# EAGLE schematic usb_speaker (EAGLE 7.7.0)
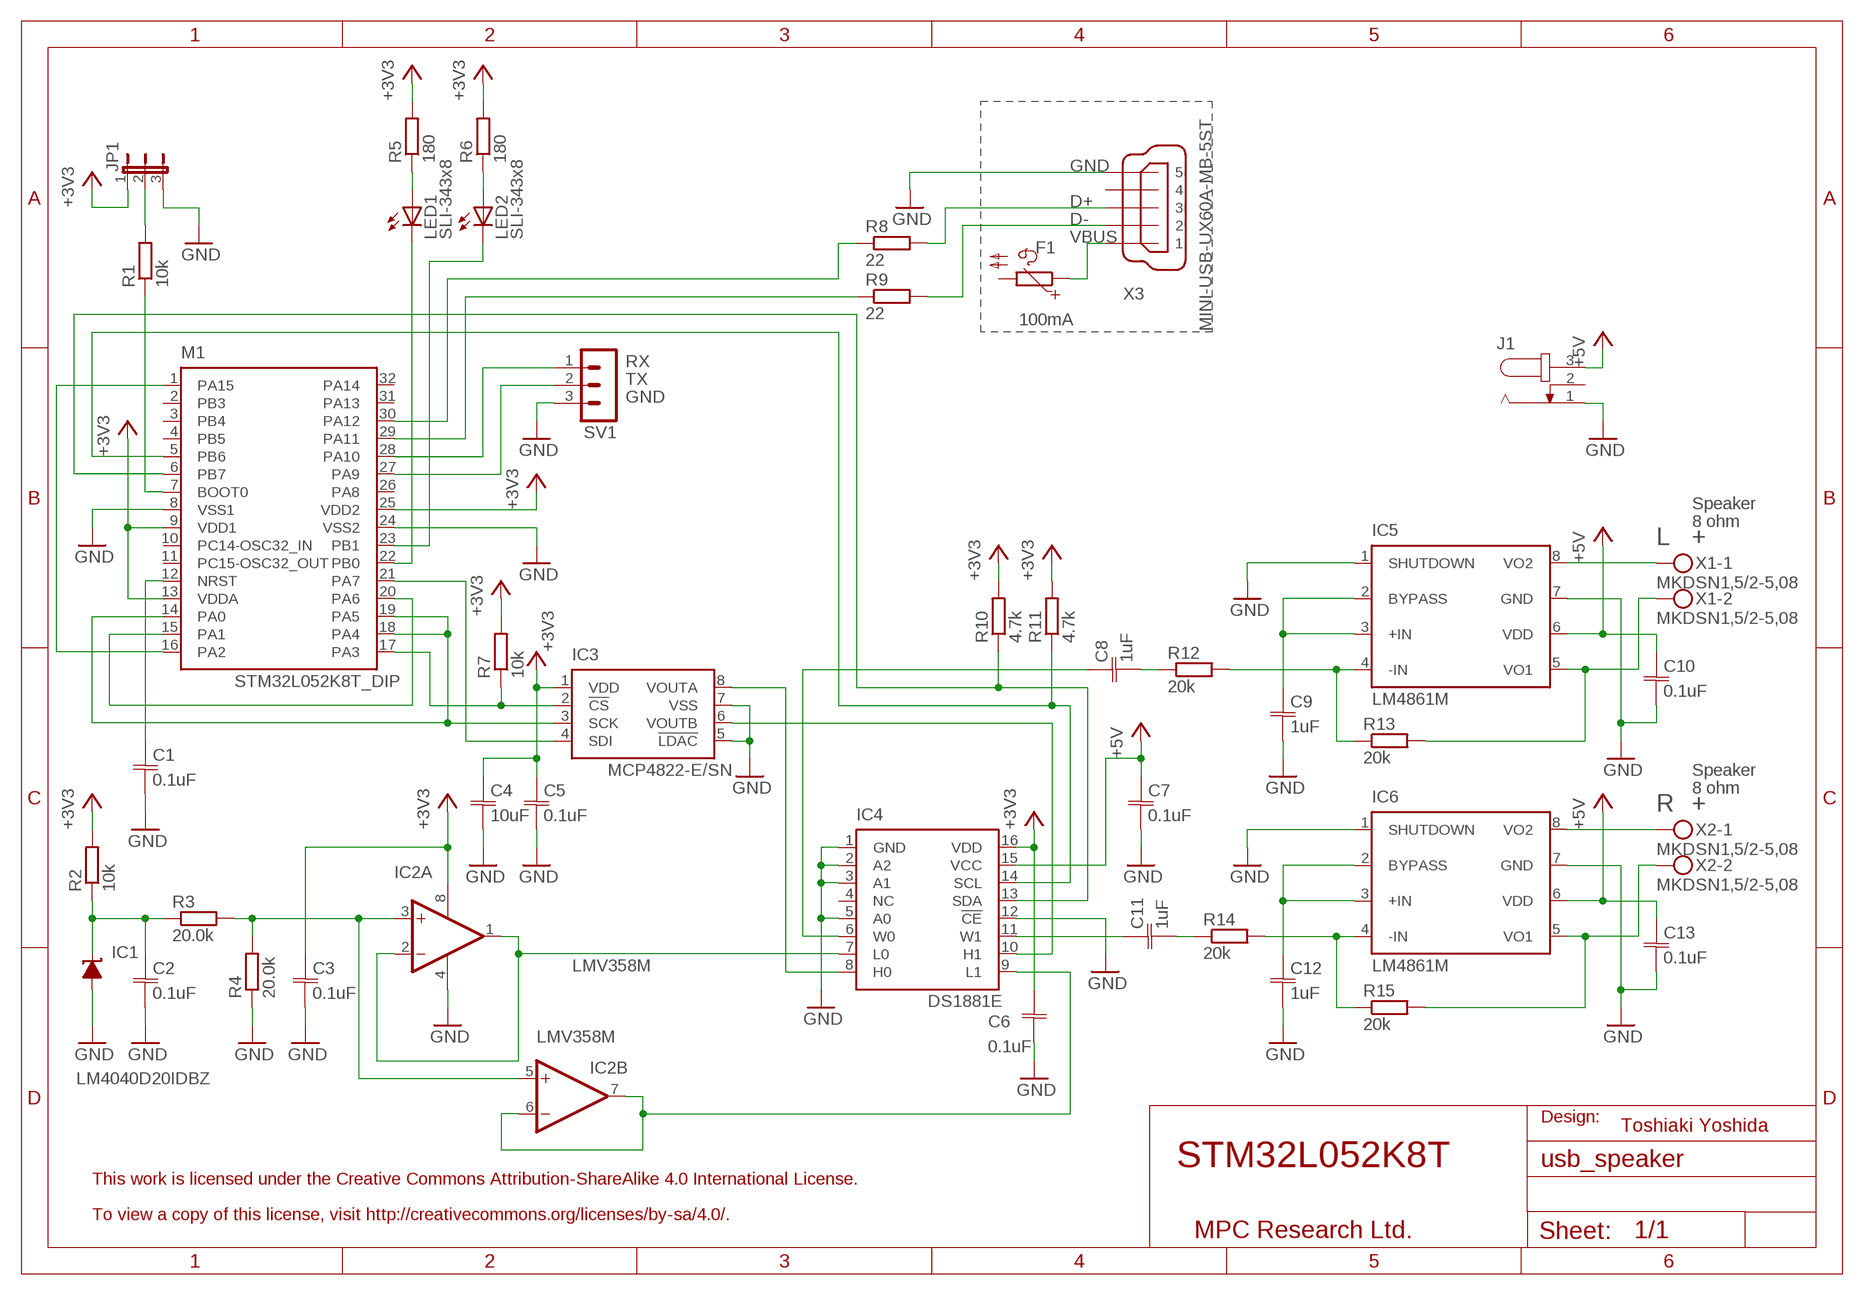
[diagram p0: schematic, sheet 1]

## Parts
C1  0.1uF  C-JIS050-024X044  [C050-024X044]
C2  0.1uF  C-JIS050-024X044  [C050-024X044]
C3  0.1uF  C-JIS050-024X044  [C050-024X044]
C4  10uF  C-JIS050-024X044  [C050-024X044]
C5  0.1uF  C-JIS050-024X044  [C050-024X044]
C6  0.1uF  C-JIS050-024X044  [C050-024X044]
C7  0.1uF  C-JIS050-024X044  [C050-024X044]
C8  1uF  C-JIS050-024X044  [C050-024X044]
C9  1uF  C-JIS050-024X044  [C050-024X044]
C10  0.1uF  C-JIS050-024X044  [C050-024X044]
C11  1uF  C-JIS050-024X044  [C050-024X044]
C12  1uF  C-JIS050-024X044  [C050-024X044]
C13  0.1uF  C-JIS050-024X044  [C050-024X044]
F1  100mA  PTC1206  [1206]
IC1  LM4040D20IDBZ  LM4041A12DBZ  [DBZ_R-PDSO-G3]
IC2  LMV358M  [SO08]
IC3  MCP4822-E/SN  [SO-08]
IC4  DS1881E  [TSSP16]
IC5  LM4861M  [SO-08]
IC6  LM4861M  [SO-08]
J1  JACK-PLUG0  [SPC4077]
JP1  JP2E  [JP2]
LED1  SLI-343x8  LED3MM  [LED3MM]
LED2  SLI-343x8  LED3MM  [LED3MM]
M1  STM32L052K8T_DIP  [DIP32]
R1  10k  R-EU_0207/2V  [0207/2V]
R2  10k  R-EU_0207/2V  [0207/2V]
R3  20.0k  R-EU_0207/2V  [0207/2V]
R4  20.0k  R-EU_0207/2V  [0207/2V]
R5  180  R-EU_0207/2V  [0207/2V]
R6  180  R-EU_0207/2V  [0207/2V]
R7  10k  R-EU_0207/2V  [0207/2V]
R8  22  R-EU_0207/10  [0207/10]
R9  22  R-EU_0207/10  [0207/10]
R10  4.7k  R-EU_0207/2V  [0207/2V]
R11  4.7k  R-EU_0207/2V  [0207/2V]
R12  20k  R-EU_0207/2V  [0207/2V]
R13  20k  R-EU_0207/10  [0207/10]
R14  20k  R-EU_0207/2V  [0207/2V]
R15  20k  R-EU_0207/10  [0207/10]
SV1  MA03-1  [MA03-1]
X1  MKDSN1,5/2-5,08  [MKDSN1,5/2-5,08]
X2  MKDSN1,5/2-5,08  [MKDSN1,5/2-5,08]
X3  MINI-USB-UX60A-MB-5ST  [UX60A-MB-5ST]

## Nets
+3V3: C3.1 C4.1 C5.1 C6.1 IC2.8(P:V+) IC3.1(VDD) IC4.16(VDD) JP1.1 M1.9(VDD1) M1.13(VDDA) M1.25(VDD2) R2.2 R5.2 R6.2 R7.2 R10.2 R11.2
+5V: C7.1 C10.1 C13.1 IC4.15(VCC) IC5.6(VDD) IC6.6(VDD) J1.3
GND: C1.2 C2.2 C3.2 C4.2 C5.2 C6.2 C7.2 C9.2 C10.2 C12.2 C13.2 IC1.2(A) IC2.4(P:V-) IC3.5(!LDAC) IC3.7(VSS) IC4.1(GND) IC4.2(A2) IC4.3(A1) IC4.5(A0) IC4.12(!CE) IC5.1(SHUTDOWN) IC5.7(GND) IC6.1(SHUTDOWN) IC6.7(GND) J1.1 JP1.3 M1.8(VSS1) M1.24(VSS2) R4.1 SV1.3 X3.5
N$1: M1.27(PA9) SV1.2
N$2: M1.7(BOOT0) R1.1
N$3: M1.28(PA10) SV1.1
N$4: C1.1 M1.12(NRST)
N$5: LED1.K(C) M1.22(PB0)
N$6: JP1.2 R1.2
N$7: LED2.A R6.1
N$8: LED2.K(C) M1.23(PB1)
N$9: LED1.A R5.1
N$10: IC3.2(!CS) M1.17(PA3) R7.1
N$11: M1.1(PA15) M1.16(PA2)
N$12: IC3.4(SDI) M1.21(PA7)
N$13: C11.1 IC4.11(W1)
N$14: C2.1 IC1.1(C) R2.1 R3.1
N$16: IC5.4(-IN) R12.2 R13.1
N$17: C8.2 R12.1
N$18: C9.1 IC5.2(BYPASS) IC5.3(+IN)
N$19: IC3.6(VOUTB) IC4.10(H1)
N$20: IC5.5(VO1) R13.2 X1.2
N$21: IC3.8(VOUTA) IC4.8(H0)
N$22: C11.2 R14.1
N$23: IC6.4(-IN) R14.2 R15.1
N$24: C12.1 IC6.2(BYPASS) IC6.3(+IN)
N$25: IC6.5(VO1) R15.2 X2.2
N$26: IC5.8(VO2) X1.1
N$27: IC6.8(VO2) X2.1
N$28: IC3.3(SCK) M1.14(PA0) M1.18(PA4) M1.19(PA5)
N$29: M1.15(PA1) M1.20(PA6)
N$30: M1.29(PA11) R9.1
N$31: M1.30(PA12) R8.1
N$32: IC2.6(B:-IN) IC2.7(B:OUT) IC4.9(L1)
N$33: R9.2 X3.2
N$34: C8.1 IC4.6(W0)
N$35: R8.2 X3.3
N$36: F1.1 X3.1
N$37: IC2.1(A:OUT) IC2.2(A:-IN) IC4.7(L0)
N$38: IC4.13(SDA) M1.6(PB7) R10.1
N$39: IC2.3(A:+IN) IC2.5(B:+IN) R3.2 R4.2
N$41: IC4.14(SCL) M1.5(PB6) R11.1
Unconnected: F1.2 IC4.4(NC) J1.2 M1.2(PB3) M1.3(PB4) M1.4(PB5) M1.10(PC14-OSC32_IN) M1.11(PC15-OSC32_OUT) M1.26(PA8) M1.31(PA13) M1.32(PA14) X3.4

## Notes on the sheet
- GND
- D+
- D-
- VBUS
- RX
- TX
- GND
- Speaker
- 8 ohm
- L | +
- Speaker
- 8 ohm
- R | +
- Design:
- Toshiaki Yoshida
- STM32L052K8T
- This work is licensed under the Creative Commons Attribution-ShareAlike 4.0 International License.
- To view a copy of this license, visit http://creativecommons.org/licenses/by-sa/4.0/.
- MPC Research Ltd.

## Library data of the parts
C1-C13 = cap:C-JIS: CAPACITOR, Japanese symbol
F1 = polyswitch:PTC: PolySwitch Resettable Device Polymeric Positive Temperature Coefficient device
IC1 = texas:LM4041: PRECISION MICROPOWER SHUNT VOLTAGE REFERENCE Source: http://focus.ti.com/lit/ds/slcs146e/slcs146e.pdf; MPN: LM4041A12IDBZR; OC_FARNELL: 1407949; OC_NEWARK: 58K5875
IC2 = linear:LMV358?*: Dual General Purpose, Low Voltage, Rail-to-Rail Output Operational Amplifiers Source: http://www.national.com/mpf/LM/LMV321.html http://www.national.com/dt/lmv_qual.pdf
IC3 = microchip:MCP48*2-E: MCP4802/4812/4822 8/10/12-Bit Dual Voltage Output Digital-to-Analog Converter with Internal VREF and SPI Interface
IC4 = maxim:DS1881: DS1881 Dual NV Audio Taper Digital Potentiometer
IC5 IC6 = ti:LM4861M: 1.1W Audio Power Amplifier with Shutdown Mode
J1 = con-jack:JACK-PLUG: DC POWER JACK Power Jack, DC, Right Angle, Through Hole, Rated 5A at 16VDC, PC Terminals Distributor: Farnell (www.Farnell.de) Drawing: 84N1161.pdf / 84N1162.pdf Manufacturer: SPC Technology (www.spctechnology.com) Type: SPC4077 / SPC 4078; OC_FARNELL: unknown; OC_NEWARK: unknown
JP1 = jumper:JP2E: JUMPER
LED1 LED2 = led:LED: LED OSRAM: - CHIPLED LG R971, LG N971, LY N971, LG Q971, LY Q971, LO R971, LY R971 LH N974, LH R974 LS Q976, LO Q976, LY Q976 LO Q996 - Hyper CHIPLED LW Q18S LB Q993, LB Q99A, LB R99A - SideLED LS A670, LO A670, LY A670, LG A670, LP A670 LB A673, LV A673, LT A673, LW A673 LH A674 LY A675 LS A676, LA A676, LO A676, LY A676, LW A676 LS A679, LY A679, LG A679 - Hyper Micro SIDELED® LS Y876, LA Y876, LO Y876, LY Y876 LT Y87S - SmartLED LW L88C, LW L88S LB L89C, LB L89S, LG L890 LS L89K, LO L89K, LY L89K LS L896, LA L896, LO L896, LY L896 - TOPLED LS T670, LO T670, LY T670, LG T670, LP T670 LSG T670, LSP T670, LSY T670, LOP T670, LYG T670 LG T671, LOG T671, LSG T671 LB T673, LV T673, LT T673, LW T673 LH T674 LS T676, LA T676, LO T676, LY T676, LB T676, LH T676, LSB T676, LW T676 LB T67C, LV T67C, LT T67C, LS T67K, LO T67K, LY T67K, LW E67C LS E67B, LA E67B, LO E67B, LY E67B, LB E67C, LV E67C, LT E67C LW T67C LS T679, LY T679, LG T679 LS T770, LO T770, LY T770, LG T770, LP T770 LB T773, LV T773, LT T773, LW T773 LH T774 LS E675, LA E675, LY E675, LS T675 LS T776, LA T776, LO T776, LY T776, LB T776 LHGB T686 LT T68C, LB T68C - Hyper Mini TOPLED® LB M676 - Mini TOPLED Santana® LG M470 LS M47K, LO M47K, LY M47K Source: http://www.osram.convergy.de LUXEON: - LUMILED® LXK2-PW12-R00, LXK2-PW12-S00, LXK2-PW14-U00, LXK2-PW14-V00 LXK2-PM12-R00, LXK2-PM12-S00, LXK2-PM14-U00 LXK2-PE12-Q00, LXK2-PE12-R00, LXK2-PE12-S00, LXK2-PE14-T00, LXK2-PE14-U00 LXK2-PB12-K00, LXK2-PB12-L00, LXK2-PB12-M00, LXK2-PB14-N00, LXK2-PB14-P00, LXK2-PB14-Q00 LXK2-PR12-L00, LXK2-PR12-M00, LXK2-PR14-Q00, LXK2-PR14-R00 LXK2-PD12-Q00, LXK2-PD12-R00, LXK2-PD12-S00 LXK2-PH12-R00, LXK2-PH12-S00 LXK2-PL12-P00, LXK2-PL12-Q00, LXK2-PL12-R00 Source: www.luxeon.com KINGBRIGHT: KA-3528ASYC Source: www.kingbright.com
M1 = stm32:STM32L052K8T_DIP
R1-R15 = resistor:R-EU_: RESISTOR, European symbol
SV1 = con-lstb:MA03-1: PIN HEADER; OC_FARNELL: unknown; OC_NEWARK: unknown
X1 X2 = con-phoenix-508:MKDSN1,5/2-5,08: MKDSN 1,5/ 2-5,08 Printklemme Nennstrom: 13,5 A Nennspannung: 250 V Rastermaß: 5,08 mm Polzahl: 2 Anschlussart: Schraubanschluss Montage: Löten Anschlussrichtung Leiter/Platine: 0 ° Artikelnummer: 1729128 Source: http://eshop.phoenixcontact.com .. 1729128.pdf
X3 = con-hirose:MINI-USB-: MINI USB Connector Source: http://www.hirose.co.jp/cataloge_hp/e24000019.pdf; OC_FARNELL: unknown; OC_NEWARK: unknown